# Altium schematic sheet BLOCK-DIAGRAM.SchDoc
size A4; SheetNumber: 2; SheetTotal: 7
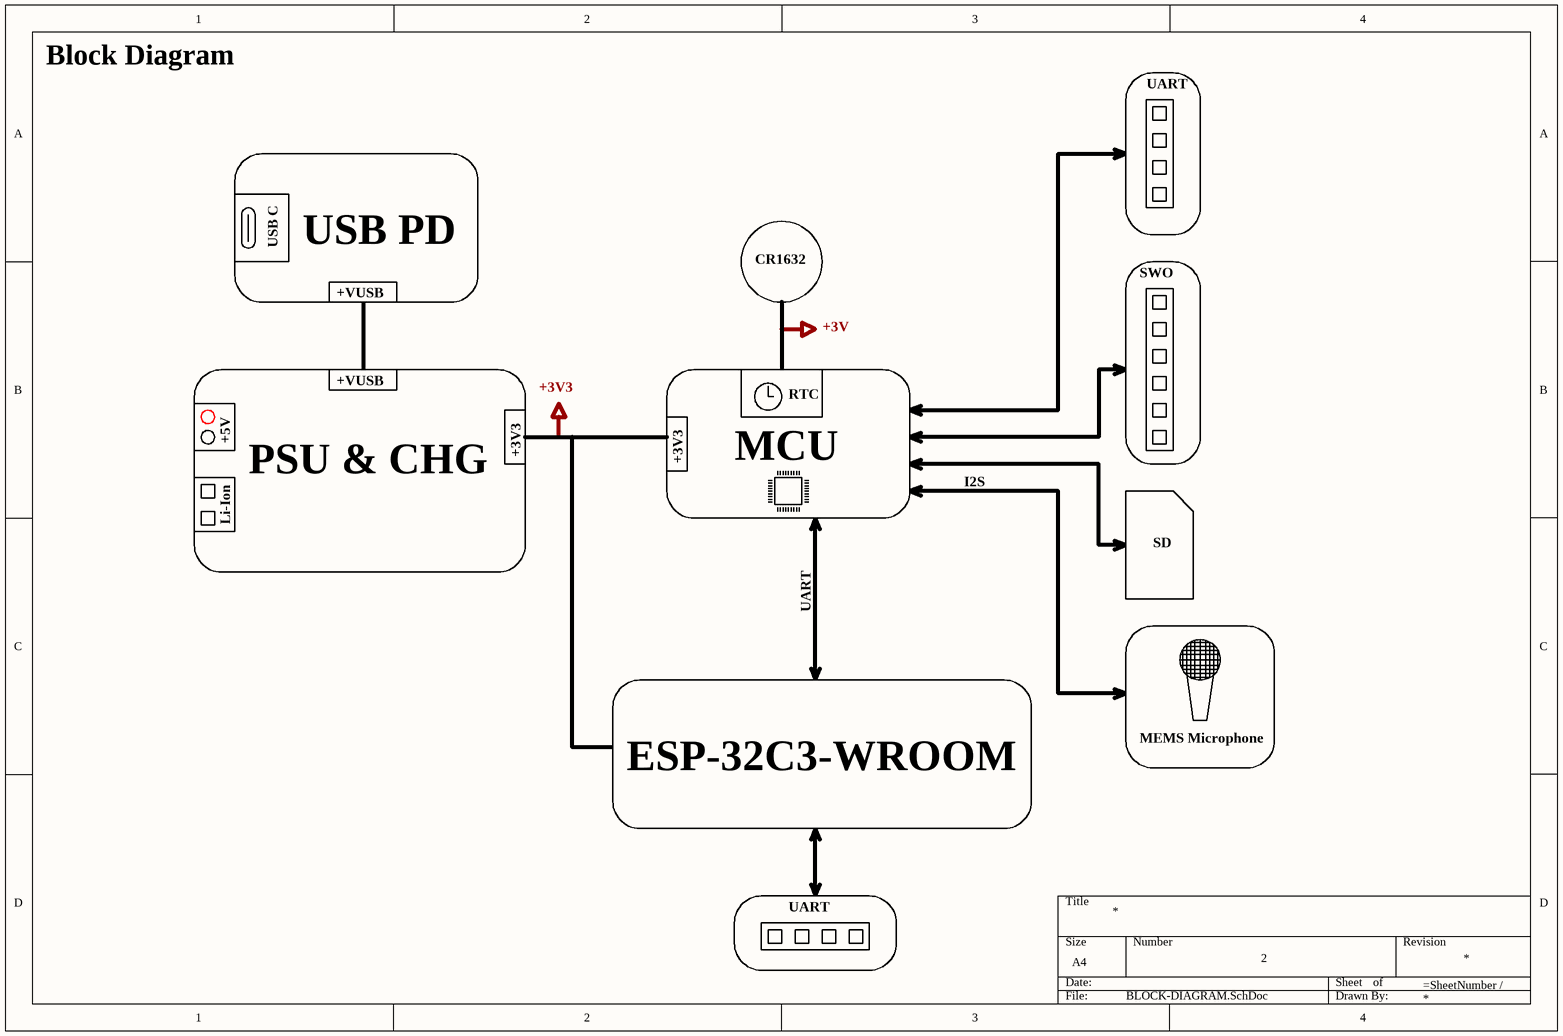
[diagram p0: BLOCK-DIAGRAM.SchDoc]

## Notes on the sheet
- Block Diagram
- UART
- USB C
- USB PD
- +VUSB
- CR1632
- SWO
- +3V
- +5V
- +3V3
- RTC
- Li-Ion
- PSU & CHG
- MCU
- I2S
- SD
- ESP-32C3-WROOM
- MEMS Microphone